# EAGLE design vc_pan (EAGLE 8.3.2)
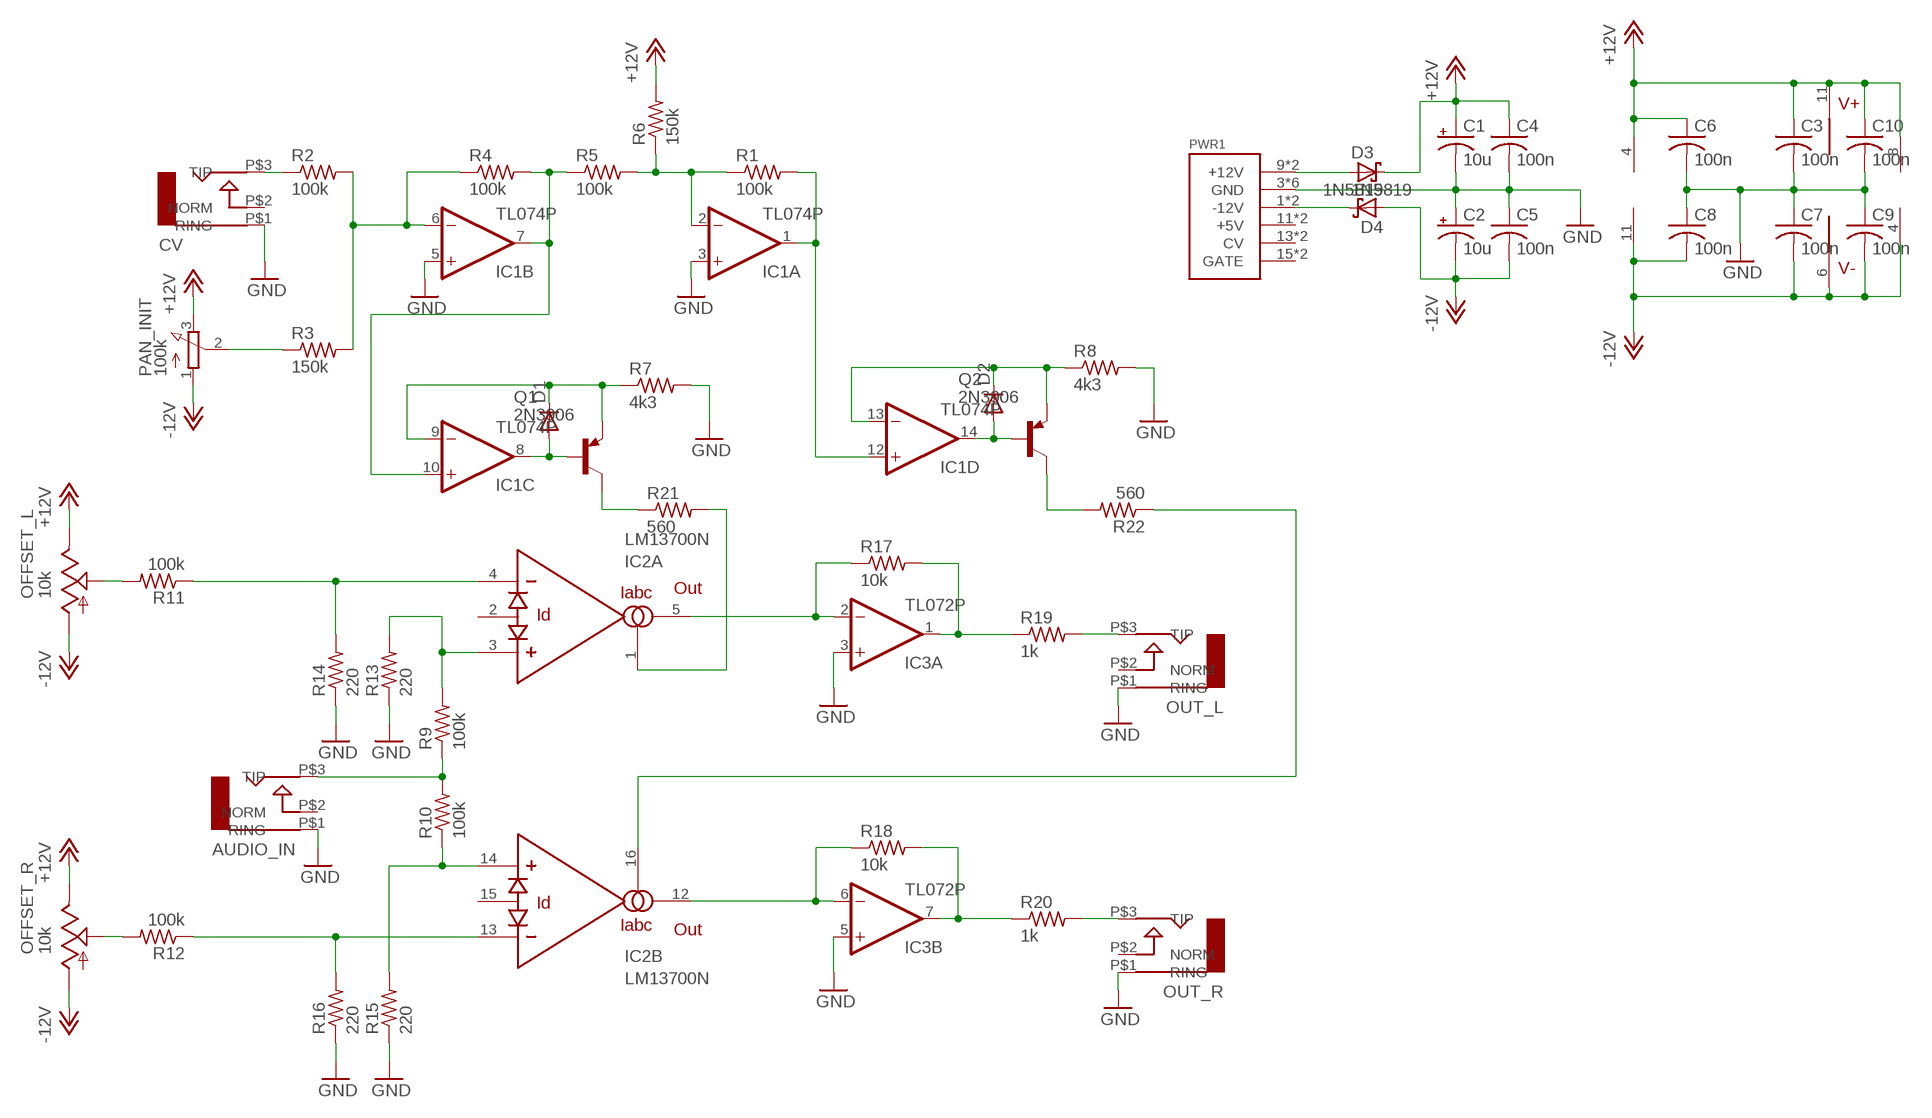
[diagram p0: schematic, sheet 1]

## Parts
AUDIO_IN  AUDIO-JACK  [ERTHENVAR-JACK-90DEG]
C1  10u  CPOL-USB45181A  [B45181A]
C2  10u  CPOL-USB45181A  [B45181A]
C3  100n  C-US050-024X044  [C050-024X044]
C4  100n  C-US050-024X044  [C050-024X044]
C5  100n  C-US050-024X044  [C050-024X044]
C6  100n  C-US050-024X044  [C050-024X044]
C7  100n  C-US050-024X044  [C050-024X044]
C8  100n  C-US050-024X044  [C050-024X044]
C9  100n  C-US050-024X044  [C050-024X044]
C10  100n  C-US050-024X044  [C050-024X044]
CV  AUDIO-JACK  [ERTHENVAR-JACK-90DEG]
D1  1N4148DO35-7  [DO35-7]
D2  1N4148DO35-7  [DO35-7]
D3  1N5819  1N5819-T  [DO41-7.6]
D4  1N5819  1N5819-T  [DO41-7.6]
IC1  TL074P  [DIL14]
IC2  LM13700N  [DIL16]
IC3  TL072P  [DIL08]
OFFSET_L  10k  TRIM_US-B64Y  [B64Y]
OFFSET_R  10k  TRIM_US-B64Y  [B64Y]
OUT_L  AUDIO-JACK  [ERTHENVAR-JACK-90DEG]
OUT_R  AUDIO-JACK  [ERTHENVAR-JACK-90DEG]
PAN_INIT  100k  3RP/1610N  [3RP/1610N]
PWR1  POWER  [POWER_16]
Q1  2N3906  [TO92]
Q2  2N3906  [TO92]
R1  100k  R-US_0207/10  [0207/10]
R2  100k  R-US_0207/10  [0207/10]
R3  150k  R-US_0207/10  [0207/10]
R4  100k  R-US_0207/10  [0207/10]
R5  100k  R-US_0207/10  [0207/10]
R6  150k  R-US_0207/10  [0207/10]
R7  4k3  R-US_0207/10  [0207/10]
R8  4k3  R-US_0207/10  [0207/10]
R9  100k  R-US_0207/10  [0207/10]
R10  100k  R-US_0207/10  [0207/10]
R11  100k  R-US_0207/10  [0207/10]
R12  100k  R-US_0207/10  [0207/10]
R13  220  R-US_0207/10  [0207/10]
R14  220  R-US_0207/10  [0207/10]
R15  220  R-US_0207/10  [0207/10]
R16  220  R-US_0207/10  [0207/10]
R17  10k  R-US_0207/10  [0207/10]
R18  10k  R-US_0207/10  [0207/10]
R19  1k  R-US_0207/10  [0207/10]
R20  1k  R-US_0207/10  [0207/10]
R21  560  R-US_0207/10  [0207/10]
R22  560  R-US_0207/10  [0207/10]

## Nets
+12V: C1.+ C3.1 C4.1 C6.1 C10.1 D3.C IC1.4(P:V+) IC2.11(V+) IC3.8(P:V+) OFFSET_L.E OFFSET_R.E PAN_INIT.3(E) R6.2
-12V: C2.- C5.2 C7.2 C8.2 C9.2 D4.A IC1.11(P:V-) IC2.6(V-) IC3.4(P:V-) OFFSET_L.A OFFSET_R.A PAN_INIT.1(A)
GND: AUDIO_IN.P$1(RING) C1.- C2.+ C3.2 C4.2 C5.1 C6.2 C7.1 C8.1 C9.1 C10.2 CV.P$1(RING) IC1.3(A:+IN) IC1.5(B:+IN) IC3.3(A:+IN) IC3.5(B:+IN) OUT_L.P$1(RING) OUT_R.P$1(RING) PWR1.3(GND) PWR1.4(GND) PWR1.5(GND) PWR1.6(GND) PWR1.7(GND) PWR1.8(GND) R7.2 R8.2 R13.1 R14.1 R15.1 R16.1
N$1: D3.A PWR1.9(+12V) PWR1.10(+12V)
N$2: D4.C PWR1.1(-12V) PWR1.2(-12V)
N$3: CV.P$3(TIP) R2.1
N$4: PAN_INIT.2(S) R3.1
N$5: IC1.6(B:-IN) R2.2 R3.2 R4.1
N$6: IC1.7(B:OUT) IC1.10(C:+IN) R4.2 R5.1
N$7: IC1.2(A:-IN) R1.1 R5.2 R6.1
N$8: IC1.1(A:OUT) IC1.12(D:+IN) R1.2
N$9: D1.A IC1.8(C:OUT) Q1.2(B)
N$10: D2.A IC1.14(D:OUT) Q2.2(B)
N$11: D1.C IC1.9(C:-IN) Q1.3(E) R7.1
N$12: D2.C IC1.13(D:-IN) Q2.3(E) R8.1
N$13: AUDIO_IN.P$3(TIP) R9.1 R10.2
N$14: IC2.3(A:+IN) R9.2 R13.2
N$15: IC2.14(B:+IN) R10.1 R15.2
N$16: IC2.4(A:-IN) R11.1 R14.2
N$17: IC2.13(B:-IN) R12.1 R16.2
N$18: OFFSET_R.S R12.2
N$19: OFFSET_L.S R11.2
N$20: IC3.7(B:OUT) R18.2 R20.1
N$21: IC2.5(A:OUT) IC3.2(A:-IN) R17.1
N$22: IC2.12(B:OUT) IC3.6(B:-IN) R18.1
N$23: IC3.1(A:OUT) R17.2 R19.1
N$24: OUT_L.P$3(TIP) R19.2
N$25: OUT_R.P$3(TIP) R20.2
N$28: Q2.1(C) R22.2
N$29: IC2.16(B:IABC) R22.1
N$30: IC2.1(A:IABC) R21.2
N$31: Q1.1(C) R21.1
Unconnected: AUDIO_IN.P$2(NORM) CV.P$2(NORM) IC2.2(A:ID) IC2.7(IN) IC2.8(OUT) IC2.9(OUT) IC2.10(IN) IC2.15(B:ID) OUT_L.P$2(NORM) OUT_R.P$2(NORM) PWR1.11(+5V) PWR1.12(+5V) PWR1.13(CV) PWR1.14(CV) PWR1.15(GATE) PWR1.16(GATE)

## Library data of the parts
AUDIO_IN CV OUT_L OUT_R = erthenvar:AUDIO-JACK: Switching Mono 3.5mm Audio Jack from Erthenvar.
C1 C2 = rcl:CPOL-US: POLARIZED CAPACITOR, American symbol
C3-C10 = rcl:C-US: CAPACITOR, American symbol
D1 D2 = diode:1N4148: DIODE high speed (Philips)
D3 D4 = diode:1N581*: 1.0A SCHOTTKY BARRIER RECTIFIER Source: http://www.diodes.com/datasheets/ds23001.pdf
IC1 = linear:TL074: OP AMP
IC2 = synthdiy updated imperial:LM13700: National Dual OTA with buffers.
IC3 = linear:TL072: OP AMP
OFFSET_L OFFSET_R = pot:TRIM_US-: POTENTIOMETER
PAN_INIT = pot:3RP/1610N: 16mm Potentiometer one level Source: http://www.alphapotentiometers.net/html/16mm_pot_2.html
PWR1 = eurorack:POWER
Q1 Q2 = transistor-pnp:2N3906: PNP Transistor
R1-R22 = rcl:R-US_: RESISTOR, American symbol

## Board
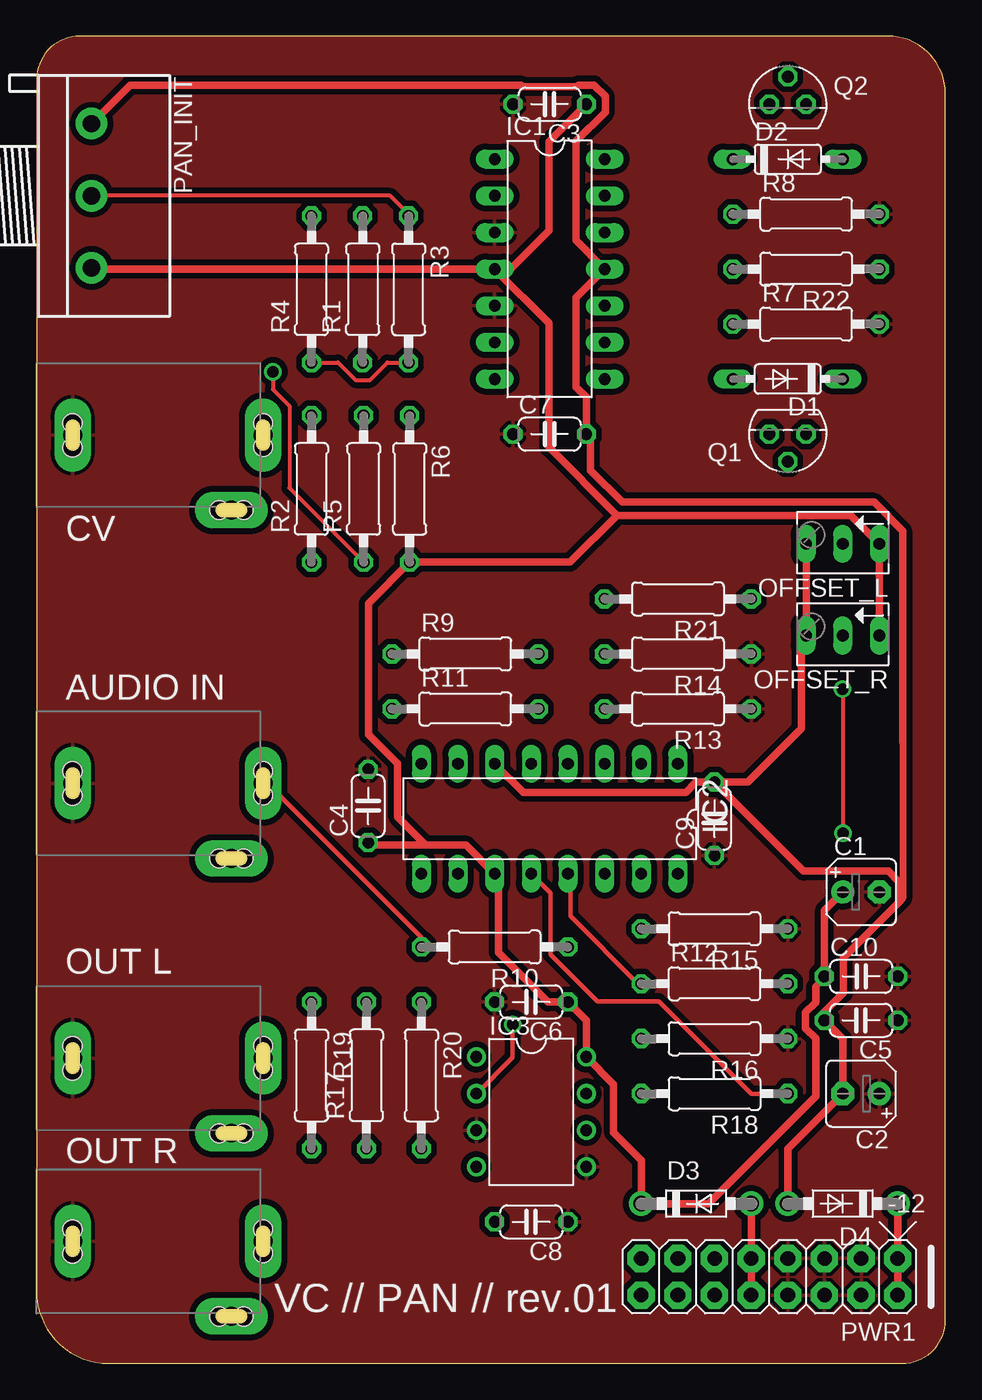
[diagram p1: board, top side]
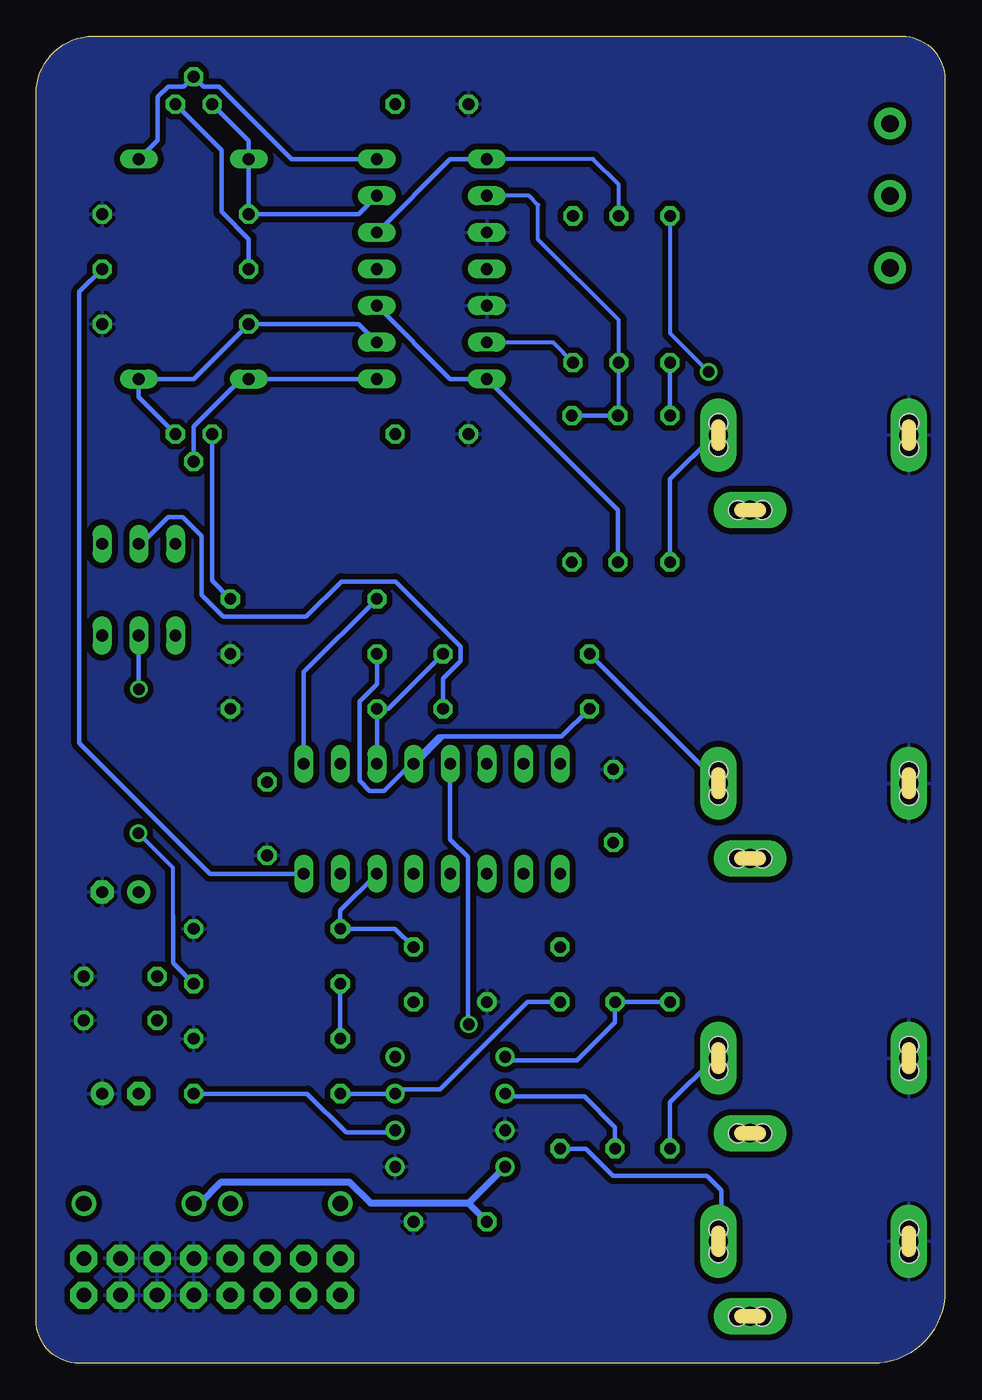
[diagram p2: board, bottom side, seen from below]

Size 63 x 92 mm. Coordinates in mm from the lower left corner, seen from the top.
Outline: 0,89 0,5 arc90 5,0 60,0 arc90 63,3 63,88 arc90 59,92 3,92 arc90 0,89
Copper layers (1*16): Top 0.035mm / dielectric 1.5mm / Bottom 0.035mm
Design rules "default *": minimum track width 10mil, minimum drill 31mil, track to track 16mil, track to pad 16mil, pad to pad 16mil, via to via 16mil, smd to smd 8mil, copper to edge 0mil, drill to drill 16mil, minimum pad ring 10mil, minimum via ring 8mil, stop-mask expansion 4mil, vias tented up to drill 0mil, thermal gap 10mil

### Footprints (pad centres in the part's own frame; a part is rotated, then mirrored left to right if it is on the bottom)
ERTHENVAR-JACK-90DEG = drill 1.3 pad 2.54 long: P$1 5,-2.5; P$2 -0.2,-13.5; P$3 5,-15.7 | hole 1.3: 5.842,-2.489; 4.14,-2.489; -0.203,-12.649; -0.203,-14.351; 5.842,-15.697; 4.166,-15.697
B45181A = drill 0.813 pad 1.6: + -1.27,0 | drill 0.813 pad 1.6 octagon: - 1.27,0
C050-024X044 = drill 0.813 octagon: 1 -2.54,0; 2 2.54,0
DO35-7 = drill 0.813 long: A 3.81,0; C -3.81,0
DO41-7.6 = drill 1.1 pad 1.7: A 3.81,0; C -3.81,0
DIL14 = drill 0.813 long: 1 -7.62,-3.81; 2 -5.08,-3.81; 3 -2.54,-3.81; 4 0,-3.81; 5 2.54,-3.81; 6 5.08,-3.81; 7 7.62,-3.81; 8 7.62,3.81; 9 5.08,3.81; 10 2.54,3.81; 11 0,3.81; 12 -2.54,3.81; 13 -5.08,3.81; 14 -7.62,3.81
DIL16 = drill 0.813 long: 1 -8.89,-3.81; 2 -6.35,-3.81; 3 -3.81,-3.81; 4 -1.27,-3.81; 5 1.27,-3.81; 6 3.81,-3.81; 7 6.35,-3.81; 8 8.89,-3.81; 9 8.89,3.81; 10 6.35,3.81; 11 3.81,3.81; 12 1.27,3.81; 13 -1.27,3.81; 14 -3.81,3.81; 15 -6.35,3.81; 16 -8.89,3.81
DIL08 = drill 0.813 pad 1.27: 1 -3.81,-3.81; 2 -1.27,-3.81; 3 1.27,-3.81; 4 3.81,-3.81; 5 3.81,3.81; 6 1.27,3.81; 7 -1.27,3.81; 8 -3.81,3.81
B64Y = drill 0.813 long: A 2.54,0; E -2.54,0; S 0,0
3RP/1610N = drill 1.2 pad 2.184: 1 -5,0; 2 0,0; 3 5,0
POWER_16 = drill 1.016 pad 1.88 octagon: 1 -6.35,-1.27; 2 -6.35,1.27; 3 -3.81,-1.27; 4 -3.81,1.27; 5 -1.27,-1.27; 6 -1.27,1.27; 7 1.27,-1.27; 8 1.27,1.27; 9 3.81,-1.27; 10 3.81,1.27; 11 6.35,-1.27; 12 6.35,1.27; 13 8.89,-1.27; 14 8.89,1.27; 15 11.43,-1.27; 16 11.43,1.27
TO92 = drill 0.813 octagon: 1 1.27,0; 2 0,1.905; 3 -1.27,0
0207/10 = drill 0.813 octagon: 1 -5.08,0; 2 5.08,0

### Placement (x,y rotation side)
AUDIO_IN  0,35.21 90 top
C1  57.15,32.67 0 top
C2  57.15,18.7 180 top
C3  35.56,87.28 180 top
C4  22.99,38.64 90 top
C5  57.15,23.78 180 top
C6  34.29,25.05 180 top
C7  35.56,64.42 0 top
C8  34.29,9.81 180 top
C9  46.99,37.75 90 top
C10  57.15,26.83 0 top
CV  0,59.34 90 top
D1  52.07,68.23 180 top
D2  52.07,83.47 0 top
D3  45.72,11.08 0 top
D4  55.88,11.08 180 top
IC1  35.56,75.85 270 top
IC2  35.56,37.75 180 top
IC3  34.29,17.43 270 top
OFFSET_L  55.88,56.8 180 top
OFFSET_R  55.88,50.45 180 top
OUT_L  0,16.16 90 top
OUT_R  0,3.46 90 top
PAN_INIT  3.81,80.93 270 top
PWR1  53.34,6 180 top
Q1  52.07,64.42 180 top
Q2  52.07,87.28 0 top
R1  22.61,74.45 90 top
R2  19.05,60.61 90 top
R3  25.78,74.45 270 top
R4  19.05,74.45 90 top
R5  22.67,60.61 90 top
R6  25.86,60.61 270 top
R7  53.34,72.04 0 top
R8  53.34,79.66 0 top
R9  29.71,49.18 0 top
R10  31.75,28.86 180 top
R11  29.71,45.37 0 top
R12  46.99,26.32 0 top
R13  44.45,45.37 180 top
R14  44.45,49.18 180 top
R15  46.99,30.13 180 top
R16  46.99,22.51 180 top
R17  22.86,19.97 90 top
R18  46.99,18.7 180 top
R19  19.05,19.97 270 top
R20  26.67,19.97 270 top
R21  44.45,52.99 180 top
R22  53.34,75.85 180 top

### Tracks (layer width: path | path; a pad name or v marks a point on that pad's centre or on a via)
+12V
  Top 0.508: C1.+ 54.61,31.4 C10.1 54,26.09 54,25.04 53.29,24.33 53.29,23.23 54,22.52 54,18.5 46.58,11.08 D3.C 41.91,14.09 40,16 40,19.34 IC3.8 38.1,23.78 C6.1 35.45,25.05 32,28.5 32,33.69 IC2.11 29.77,35.92 26.98,35.92 | 58.5,50.37 OFFSET_R.E OFFSET_L.E 58.41,56.8 56.43,58.78 40.22,58.78 | 40.22,58.78 35.5,63.5 35.5,72.1 IC1.4 | 40.22,58.78 36.97,55.53 R6.2 23,52.67 23,43.59 25.02,41.57 25.02,37.88 26.98,35.92 | IC1.4 3.89,75.85 PAN_INIT.3 | IC1.4 32.85,75.85 35.5,78.5 35.5,84.68 C3.1 | C4.1 23.16,35.92 26.98,35.92
-12V
  Top 0.5: 60.04,43.04 60.04,32.23 59.71,31.89
  Top 0.508: D4.A 52.07,14.89 C2.- 55.88,22.51 C5.2 54.61,24.36 55.93,25.68 55.93,28.11 59.71,31.89 59.88,32.06 59.88,33.27 59.02,34.13 53.15,34.13 C9.2 | C9.2 45.71,40.29 45,39.58 33.73,39.58 IC2.6 | C9.2 49.29,40.29 53,44 53,50.11 OFFSET_R.A OFFSET_L.A | 60.04,43.04 60.04,57.71 58.05,59.7 40.6,59.7 38.4,61.9 38.4,64.12 C7.2 38.1,66.97 37.39,67.68 37.39,73.87 IC1.11 39.37,75.86 37.39,77.84 37.39,84.7 39.42,86.73 39.42,87.83 38.65,88.6 37.55,88.6 37.45,88.5 33.67,88.5 33.57,88.6 6.48,88.6 PAN_INIT.1
  Bottom 0.5: D4.A 51.66,11.08 50.15,12.59 41.29,12.59 39.83,11.13 33.07,11.13 | 33.07,11.13 C8.2 | 33.07,11.13 32.97,11.13 IC3.4
GND
  pour Bottom: 0,6 0,5 arc90 5,0 60,0 arc90 63,3 63,88 arc90 59,92 3,92 arc90 0,89
  pour Top: 0,7 0,5 arc90 5,0 60,0 arc90 63,3 63,88 arc90 59,92 3,92 arc90 0,89
N$1
  Top 0.508: PWR1.10 PWR1.9 D3.A
N$2
  Top 0.508: PWR1.2 PWR1.1 D4.C
N$3
  Bottom 0.3: CV.P$3 15.73,64.31 16.03,64.31 19.05,61.28 R2.1
N$4
  Top 0.292: R3.1 25.78,79.66 24.51,80.93 PAN_INIT.2
N$5
  Top 0.292: R4.1 20.89,69.37 22.1,68.16 23.11,68.16 24.32,69.37 R3.2
  Bottom 0.292: IC1.6 27.18,70.77 R3.2
  Bottom 0.3: R2.2 R4.1
N$6  (via drill 0.8 pad 0.8)
  Top 0.292: v16.38,68.74 16.38,67.5 17.52,66.37 17.52,60.68 R5.1
  Bottom 0.292: R4.2 19.05,71.41 v16.38,68.74
  Bottom 0.3: R5.1 22.67,59.15 IC1.7 34.29,68.23 IC1.10
N$7
  Bottom 0.292: R5.2 22.61,65.75 R1.1 22.61,72.29 28.19,77.88 28.19,80.3 28.83,80.93 IC1.2
  Bottom 0.3: R5.2 R6.1
N$8
  Bottom 0.292: R1.2 22.61,81.69 24.38,83.47 31.88,83.47
  Bottom 0.3: IC1.1 31.88,83.47 34.29,83.47 IC1.12
N$9
  Bottom 0.3: Q1.2 52.07,64.93 49,68 48.49,68 D1.A IC1.8
N$10
  Bottom 0.3: IC1.14 45.27,83.47 50.3,88.5 51.38,88.5 Q2.2 52.76,88.5 53.84,88.5 54.56,87.78 54.56,84.79 D2.A
N$11
  Bottom 0.3: IC1.9 40.64,72.04 R7.1 52.07,68.23 D1.C 55.88,66.96 Q1.3
N$12
  Bottom 0.3: Q2.3 48.26,84.74 D2.C R8.1 40.64,79.66 IC1.13
N$13
  Top 0.3: AUDIO_IN.P$3 15.73,40.18 16.03,40.18 26.67,29.53 R10.2
  Bottom 0.3: R9.1 16.5,41.05 16.5,40.72 16.03,40.25 15.74,40.25 AUDIO_IN.P$3
N$14
  Bottom 0.3: IC2.3 R13.2 38.6,45.37 R9.2
N$15
  Bottom 0.3: R10.1 38.1,30.13 R15.2 41.91,31.4 IC2.14
N$16
  Bottom 0.3: R11.1 26.56,43.44 34.79,43.44 | IC2.4 36.67,41.56 34.79,43.44 | R14.2 39.37,47.09 40.59,45.87 40.59,40.4 39.87,39.68 38.87,39.68 35.11,43.44 34.79,43.44
N$17
  Top 0.3: R12.1 41.68,26.32 37,31 37,33.77 IC2.13
  Bottom 0.3: R16.2 R12.1
N$18  (via drill 0.8 pad 0.8)
  Top 0.292: v55.91,36.76 55.91,46.71 v55.88,46.74
  Bottom 0.292: 53.5,31 53.5,34.35 v55.91,36.76
  Bottom 0.3: OFFSET_R.S v55.88,46.74 | 53.5,31 53.5,28.2 53.49,27.75 53.39,27.64 R12.2
N$19
  Bottom 0.3: OFFSET_L.S 55.72,56.8 53.84,58.68 52.84,58.68 51.51,57.35 51.51,53.25 50.03,51.77 44.27,51.77 41.83,54.21 38.1,54.21 33.57,49.68 33.57,48.68 34.79,47.46 R11.2
N$20
  Bottom 0.3: R20.1 28.95,25.05 35,19 37.8,19 IC3.7 R18.2
N$21  (via drill 0.8 pad 0.8)
  Top 0.3: v33,23.5 33,21.22 IC3.2
  Bottom 0.3: R17.1 22.86,16.36 25,18.5 30.28,18.5 IC3.2 | IC2.5 34.29,36.32 33.07,35.1 33.07,23.57 v33,23.5
N$22
  Top 0.3: R18.1 49.53,18.7 43.13,25.1 38.87,25.1 35.61,28.36 35.61,32.62 IC2.12
  Bottom 0.3: R18.1 44.2,18.7 41.5,16 38.26,16 IC3.6
N$23
  Bottom 0.3: R19.1 R17.2 22.86,23.64 25.5,21 30.24,21 IC3.1
N$24
  Bottom 0.3: OUT_L.P$3 15.73,21.13 16.03,21.13 19.05,18.1 R19.2
N$25
  Bottom 0.3: R20.2 24.89,14.89 23,13 16.5,13 15.5,12 15.5,10.24 14.9,9.63 14.9,8.97 15.37,8.5 15.66,8.5 OUT_R.P$3
N$28
  Bottom 0.3: R22.2 48.26,77.94 50.14,79.82 50.14,84.08 Q2.1
N$29
  Bottom 0.3: IC2.16 50.94,33.94 60,43 60,74.27 R22.1
N$30
  Bottom 0.3: IC2.1 44.45,47.91 R21.2
N$31
  Bottom 0.3: Q1.1 50.8,54.26 R21.1

### Text on the board
tNames: CV | AUDIO IN | OUT L | OUT R | VC // PAN // rev.01